# EAGLE design bq25570 (EAGLE 7.2.0)
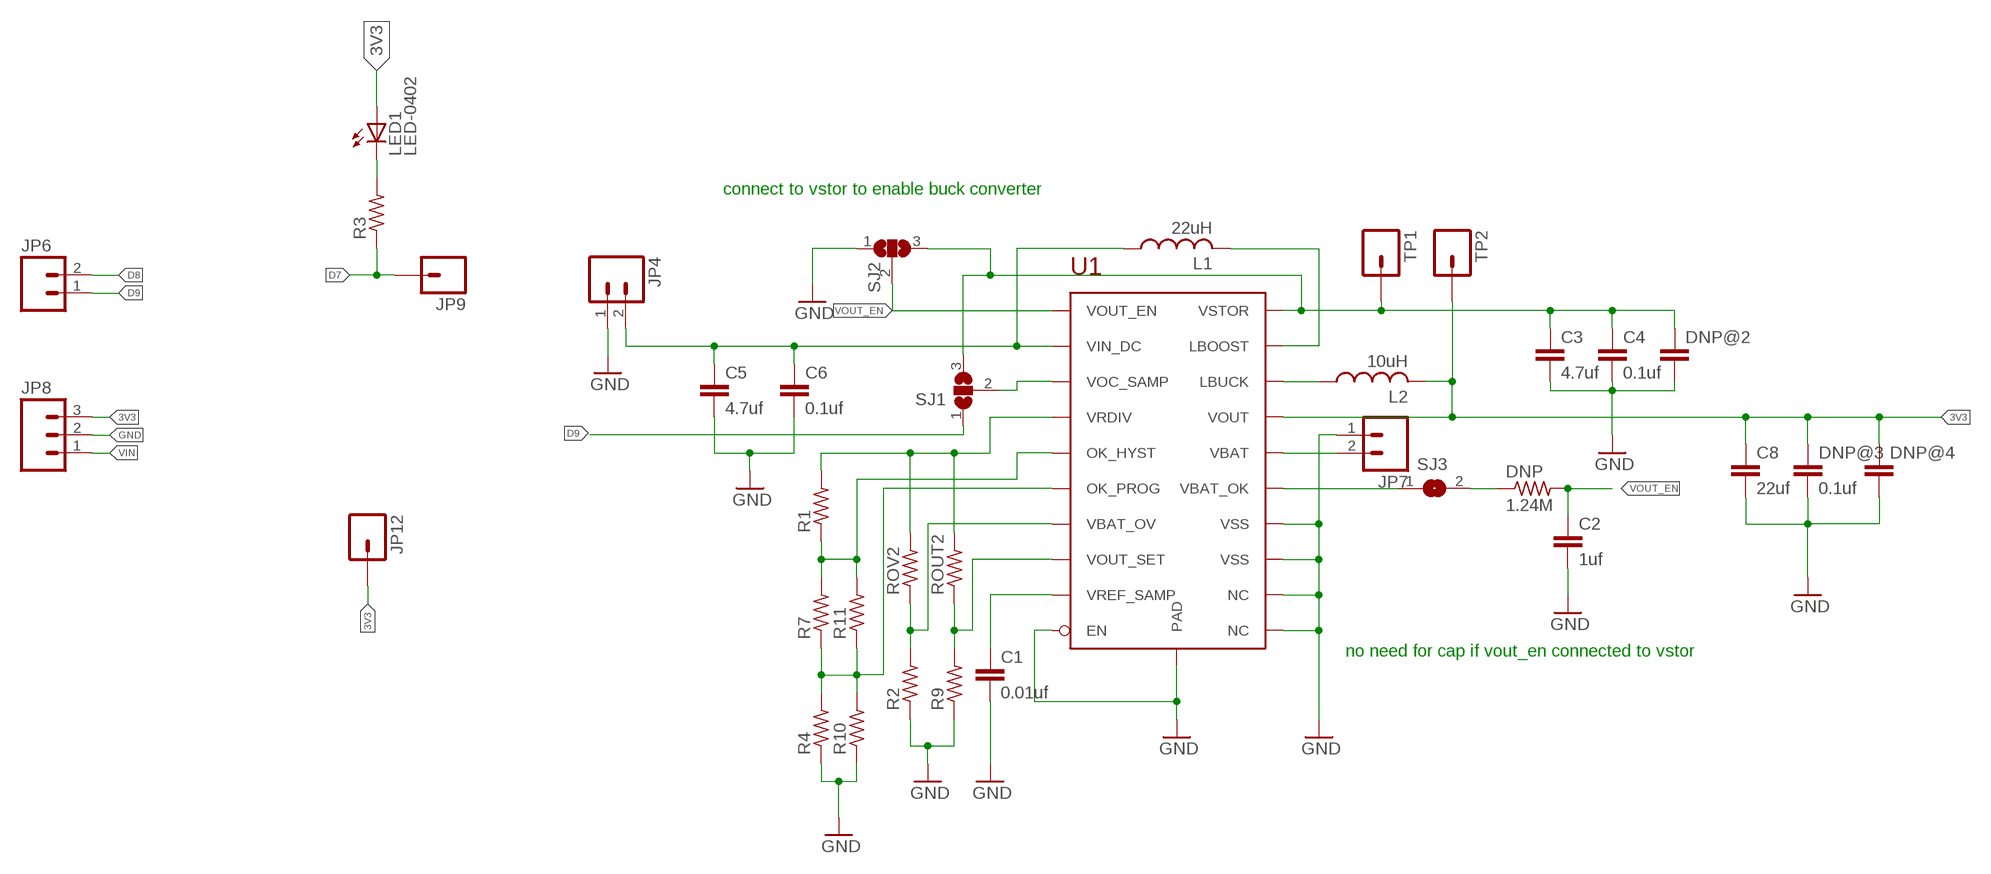
[diagram p0: schematic, sheet 1]

## Parts
C1  0.01uf  C-EUC0805  [C0805]
C2  1uf  C-EUC0805  [C0805]
C3  4.7uf  C-EUC0805  [C0805]
C4  0.1uf  C-EUC0805  [C0805]
C5  4.7uf  C-EUC0805  [C0805]
C6  0.1uf  C-EUC0805  [C0805]
C8  22uf  C-EUC0805  [C0805]
DNP  1.24M  R-US_M0805  [M0805]
DNP@2  C-EUC0805  [C0805]
DNP@3  0.1uf  C-EUC0805  [C0805]
DNP@4  C-EUC0805  [C0805]
JP4  M02-JST-2-PTH-NO_SILK  [JST-2-PTH-NS]
JP6  M02PTH  [1X02]
JP7  M02-JST-2-PTH-NO_SILK  [JST-2-PTH-NS]
JP8  M03PTH  [1X03]
JP9  M01PTH  [1X01]
JP12  M01PTH  [1X01]
L1  22uH  LPS6235  [LPS6235]
L2  10uH  LPS6235  [LPS6235]
LED1  LED-0402  [0402]
R1  R-US_R0603  [R0603]
R2  R-US_R0603  [R0603]
R3  R-US_R0603  [R0603]
R4  R-US_R0603  [R0603]
R7  R-US_R0805  [R0805]
R9  R-US_R0805  [R0805]
R10  R-US_R0805  [R0805]
R11  R-US_R1206  [R1206]
ROUT2  R-US_R0603  [R0603]
ROV2  R-US_R0805  [R0805]
SJ1  SJ2W  [SJ_2]
SJ2  SJ2W  [SJ_2]
SJ3  SJ  [SJ]
TP1  M01PTH  [1X01]
TP2  M01PTH  [1X01]
U1  BQ25570  [QFN-20]

## Nets
3V3: C8.1 DNP@3.1 DNP@4.1 JP8.3 JP12.1 L2.P$2 LED1.P$1(A) TP2.1 U1.P$14(VOUT)
D7: JP9.1 R3.1
D8: JP6.2
D9: JP6.1 SJ1.1
GND: C1.2 C2.2 C3.2 C4.2 C5.2 C6.2 C8.2 DNP@2.2 DNP@3.2 DNP@4.2 JP4.1 JP7.1 JP8.2 R2.1 R4.1 R9.1 R10.1 SJ2.1 U1.P$1(VSS) U1.P$5(EN) U1.P$9(NC) U1.P$15(VSS) U1.P$17(NC) U1.P$21(PAD)
N$1: L1.P$2 U1.P$20(LBOOST)
N$3: L2.P$1 U1.P$16(LBUCK)
N$4: SJ1.2 U1.P$3(VOC_SAMP)
N$6: JP7.2 U1.P$18(VBAT)
N$7: C1.1 U1.P$4(VREF_SAMP)
N$8: SJ3.1 U1.P$13(VBAT_OK)
N$10: R1.2 ROUT2.2 ROV2.2 U1.P$8(VRDIV)
N$11: DNP.1 SJ3.2
N$12: R9.2 ROUT2.1 U1.P$12(VOUT_SET)
N$13: R2.2 ROV2.1 U1.P$7(VBAT_OV)
N$14: R1.1 R7.2 R11.2 U1.P$10(OK_HYST)
N$16: LED1.P$2(C) R3.2
N$17: R4.2 R7.1 R10.2 R11.1 U1.P$11(OK_PROG)
VIN: JP8.1
VIN_DC: C5.1 C6.1 JP4.2 L1.P$1 U1.P$2(VIN_DC)
VOUT_EN: C2.1 DNP.2 SJ2.2 U1.P$6(VOUT_EN)
VSTOR: C3.1 C4.1 DNP@2.1 SJ1.3 SJ2.3 TP1.1 U1.P$19(VSTOR)

## Notes on the sheet
- connect to vstor to enable buck converter
- no need for cap if vout_en connected to vstor

## Library data of the parts
C1-C6 C8 DNP@2-DNP@4 = rcl:C-EU: CAPACITOR, European symbol
DNP R1 R2 R4 R7 R9-R11 ROUT2 ROV2 = rcl:R-US_: RESISTOR, American symbol
JP4 JP6 JP7 = SparkFun-Connectors:M02: Standard 2-pin 0.1" header. Use with - straight break away headers ( PRT-00116) - right angle break away headers (PRT-00553) - swiss pins (PRT-00743) - machine pins (PRT-00117) - female headers (PRT-00115) Molex polarized connector foot print use with: PRT-08233 with associated crimp pins and housings. 2.54_SCREWTERM for use with PRT-10571. 3.5mm Screw Terminal footprints for PRT-08084 5mm Screw Terminal footprints for use with PRT-08432
JP8 = SparkFun-Connectors:M03: Header 3 Standard 3-pin 0.1" header. Use with straight break away headers (SKU : PRT-00116), right angle break away headers (PRT-00553), swiss pins (PRT-00743), machine pins (PRT-00117), and female headers (PRT-00115). Molex polarized connector foot print use with SKU : PRT-08232 with associated crimp pins and housings.
JP9 JP12 TP1 TP2 = SparkFun-Connectors:M01: Header 1 Standard 1-pin 0.1" header. Use with straight break away headers (SKU : PRT-00116), right angle break away headers (PRT-00553), swiss pins (PRT-00743), machine pins (PRT-00117), and female headers (PRT-00115).
L1 L2 = lps6235:LPS6235
LED1 = led-0402:LED-0402
R3 = resistor:R-US_: RESISTOR, American symbol
SJ1 SJ2 = jumper:SJ2W: SMD solder JUMPER
SJ3 = jumper:SJ: SMD solder JUMPER
U1 = bq25570:BQ25570

## Board
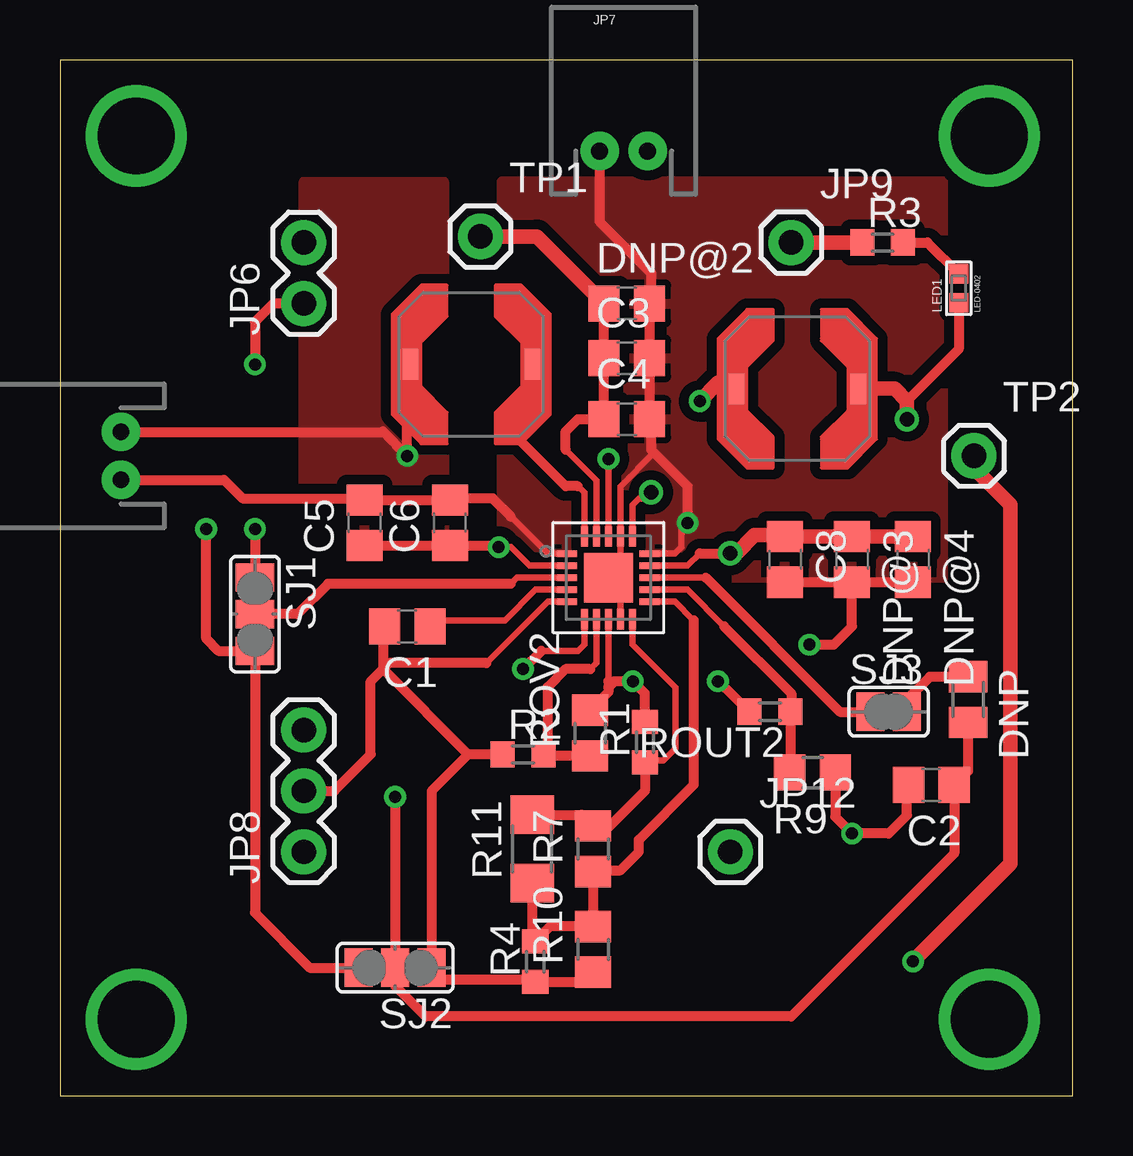
[diagram p1: board, top side]
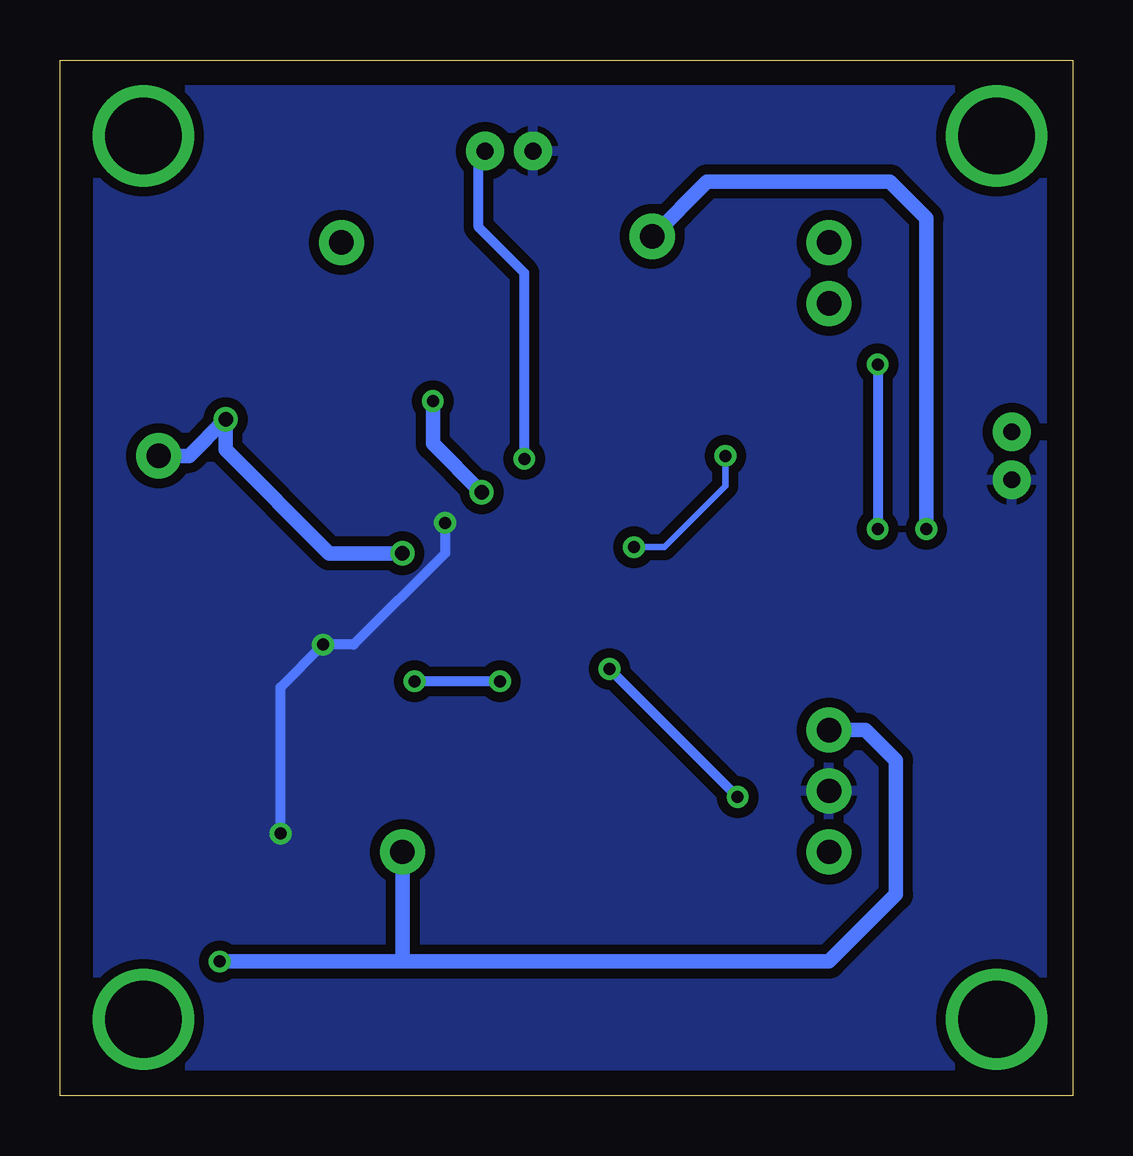
[diagram p2: board, bottom side, seen from below]

Size 42.22 x 43.17 mm. Coordinates in mm from the lower left corner, seen from the top.
Outline: 0,0 42.22,0 42.22,43.17 0,43.17 0,0
Copper layers (1*16): Top 0.035mm / dielectric 1.5mm / Bottom 0.035mm
Design rules "default": minimum track width 10mil, minimum drill 24mil, track to track 8mil, track to pad 8mil, pad to pad 8mil, via to via 8mil, smd to smd 8mil, copper to edge 40mil, drill to drill 8mil, minimum pad ring 10mil, minimum via ring 8mil, stop-mask expansion 4mil, vias tented up to drill 0mil, thermal gap 10mil

### Footprints (pad centres in the part's own frame; a part is rotated, then mirrored left to right if it is on the bottom)
C0805 = smd 1.3 x 1.5: 1 -0.95,0; 2 0.95,0
M0805 = smd 1.3 x 1.6: 1 -0.95,0; 2 0.95,0
JST-2-PTH-NS = drill 0.7 pad 1.6: 1 -1,0; 2 1,0
1X02 = drill 1.016 pad 1.88: 1 0,0; 2 2.54,0
1X03 = drill 1.016 pad 1.88: 1 0,0; 2 2.54,0; 3 5.08,0
1X01 = drill 1.016 pad 1.88: 1 0,0
LPS6235 = smd 0.635 x 1.27: P$1 -2.54,0; P$2 2.54,0
0402 = smd 0.8 x 0.8: P$1 -0.6,0; P$2 0.6,0
R0603 = smd 1 x 1.1: 1 -0.85,0; 2 0.85,0
R0805 = smd 1.3 x 1.5: 1 -0.95,0; 2 0.95,0
R1206 = smd 1.6 x 1.803: 1 -1.422,0; 2 1.422,0
SJ_2 = smd 1.168 x 1.6: 1 -1.524,0; 2 0,0; 3 1.524,0
SJ = smd 1.168 x 1.6: 1 -0.762,0; 2 0.762,0
QFN-20 = smd 0.85 x 0.28: P$1 -1.725,1; P$2 -1.725,0.5; P$3 -1.725,0; P$4 -1.725,-0.5; P$5 -1.725,-1; P$11 1.725,-1; P$12 1.725,-0.5; P$13 1.725,0; P$14 1.725,0.5; P$15 1.725,1 | smd 0.28 x 0.85: P$6 -1,-1.725; P$7 -0.5,-1.725; P$8 0,-1.725; P$9 0.5,-1.725; P$10 1,-1.725; P$16 1,1.725; P$17 0.5,1.725; P$18 0,1.725; P$19 -0.5,1.725; P$20 -1,1.725 | smd 2.05 x 2.05: P$21 0,0

### Placement (x,y rotation side)
C1  14.48,19.56 180 top
C2  36.32,12.95 180 top
C3  23.62,30.73 0 top
C4  23.62,28.19 0 top
C5  12.7,23.88 90 top
C6  16.26,23.88 90 top
C8  30.23,22.35 270 top
DNP  37.85,16.51 270 top
DNP@2  23.62,33.02 0 top
DNP@3  33.02,22.35 270 top
DNP@4  35.56,22.35 270 top
JP4  2.54,26.67 90 top
JP6  10.16,33.02 90 top
JP7  23.49,39.37 0 top
JP8  10.16,10.16 90 top
JP9  30.48,35.56 0 top
JP12  27.94,10.16 0 top
L1  17.15,30.48 0 top
L2  30.73,29.46 0 top
LED1  37.47,33.66 90 top
R1  24.38,14.73 90 top
R2  19.3,14.22 0 top
R3  34.29,35.56 0 top
R4  19.81,5.59 90 top
R7  22.23,10.29 90 top
R9  31.37,13.46 180 top
R10  22.23,6.1 90 top
R11  19.69,10.29 90 top
ROUT2  29.59,16 180 top
ROV2  22.1,15.11 90 top
SJ1  8.13,20.07 270 top
SJ2  13.97,5.33 180 top
SJ3  34.54,16 0 top
TP1  17.53,35.81 0 top
TP2  38.1,26.67 0 top
U1  22.86,21.59 0 top

### Tracks (layer width: path | path; a pad name or v marks a point on that pad's centre or on a via)
3V3  (via drill 0.5, 0.6)
  Top 0.279: U1.P$14 26.15,22.09 26.67,22.61
  Top 0.406: 26.67,22.61 v27.94,22.61 | 35.31,28.96 37.47,31.11 LED1.P$1
  Top 0.61: v35.31,28.19 35.31,28.96 34.8,29.46 L2.P$2 | DNP@4.1 DNP@3.1 C8.1 30.16,23.37 28.96,23.37 28.19,22.61 v27.94,22.61 | TP2.1 38.1,26.16 39.62,24.64 39.62,9.65 v35.56,5.59
  Bottom 0.61: v27.94,22.61 30.99,22.61 35.31,26.92 v35.31,28.19 36.83,26.67 TP2.1 | v35.56,5.59 27.94,5.59 | 27.94,5.59 10.16,5.59 7.37,8.38 7.37,13.97 8.64,15.24 JP8.3 | JP12.1 27.94,5.59
D7
  Top 0.61: JP9.1 R3.1
D9  (via drill 0.5)
  Top 0.406: v8.13,23.62 SJ1.1 | JP6.1 8.89,33.02 8.13,32.26 v8.13,30.48
  Bottom 0.406: v8.13,30.48 v8.13,23.62
GND  (via drill 0.5)
  Top 0.279: U1.P$9 23.36,21.09 U1.P$21 23.37,22.1 23.37,22.35 23.36,22.36 U1.P$17 23.36,25.39 24.77,26.8 | 24.64,27.87 C4.2 | U1.P$5 20.34,20.59 17.78,18.03 | U1.P$15 25.64,22.59 25.91,22.86 25.91,23.62 v26.16,23.88 | U1.P$1 20.34,22.59 18.8,24.13
  Top 0.406: C4.2 C3.2 DNP@2.2 24.64,33.09 24.64,34.29 22.49,36.43 JP7.1 | R10.1 21.82,4.74 R4.1 19.72,4.83 16,4.83 SJ2.1 15.49,12.7 17.02,14.22 | C8.2 DNP@3.2 | DNP@3.2 DNP@4.2 | C2.2 35.31,12.89 35.31,11.68 34.54,10.92 v33.02,10.92 32.32,11.62 R9.1 | v31.24,18.8 32.26,18.8 33.02,19.56 DNP@3.2 | 24.64,27.87 24.64,26.92 24.77,26.8 26.16,25.4 v26.16,23.88 | 18.8,24.13 18.03,24.89 16.32,24.89 C6.2 C5.2 12.63,24.89 7.62,24.89 6.84,25.67 JP4.1 | JP8.2 11.43,12.7 12.95,14.22 12.95,17.27 13.46,17.78 | C1.2 13.46,19.49 13.46,17.78 | R2.1 17.02,14.22 | 13.46,17.78 17.02,14.22 | 17.78,18.03 13.72,18.03 13.46,17.78
  Bottom 0.406: v26.16,23.88 26.16,22.61 29.97,18.8 v31.24,18.8 33.02,17.02 v33.02,10.92
  pour Bottom (isolate 0.406): 1.27,41.91 40.64,41.91 40.64,1.27 1.27,1.27
  pour Top (isolate 0.406): 36.83,38.1 18.41,38.1 18.41,21.59 36.83,21.59
N$1
  Top 0.279: U1.P$20 21.86,25.13 21.59,25.4
  Top 0.406: 19.05,27.94 19.05,28.96 | 19.05,28.96 19.56,29.46 19.56,30.35 L1.P$2 | 21.59,25.4 21.08,25.4 18.54,27.94 18.54,28.45 19.05,28.96
N$2  (via drill 3.2)
  other vias: 38.73,40.01
N$3  (via drill 0.5, 0.6)
  Top 0.279: U1.P$16 23.86,24.62 24.13,24.89 24.38,24.89 v24.64,25.15
  Top 0.406: 28.19,28.96 L2.P$1 27.94,29.72 27.43,29.72
  Top 0.61: v26.67,28.96 27.43,29.72
  Bottom 0.61: v24.64,25.15 26.67,27.18 v26.67,28.96
N$4
  Top 0.279: U1.P$3 19.05,21.59 18.8,21.34
  Top 0.406: 18.8,21.34 11.18,21.34 9.91,20.07 SJ1.2
N$5  (via drill 3.2)
  other vias: 38.73,3.17
N$6  (via drill 0.5)
  Top 0.279: U1.P$18 v22.86,26.54
  Bottom 0.406: v22.86,26.54 22.86,34.29 24.77,36.2 24.77,39.1 JP7.2
N$7
  Top 0.279: U1.P$4 19.82,21.09 18.54,19.81 15.68,19.81 C1.1
N$8
  Top 0.279: U1.P$13 26.92,21.59
  Top 0.406: 26.92,21.59 32.51,16 SJ3.1
N$9  (via drill 3.2)
  other vias: 3.18,3.17
N$10  (via drill 0.5)
  Top 0.279: U1.P$8 22.86,17.27
  Top 0.406: 22.86,17.27 22.86,17.02 | 22.86,17.02 22.86,16.82 ROV2.2 | R1.2 24.38,16.76 v23.88,17.27 23.11,17.27 22.86,17.02 | v27.43,17.27 27.47,17.27 ROUT2.2
  Bottom 0.406: v23.88,17.27 v27.43,17.27
N$11
  Top 0.406: DNP.1 36.26,17.46 35.31,16.51 SJ3.2
N$12
  Top 0.279: U1.P$12 26.15,21.09 27.69,19.56
  Top 0.406: 30.44,13.56 R9.2 30.44,13.48 ROUT2.1 30.48,16.04 30.48,16.76 27.69,19.56
N$13
  Top 0.279: U1.P$7 22.36,18.04 22.1,17.78 | 20.32,14.39 R2.2
  Top 0.406: ROV2.1 20.22,14.16 R2.2 | 22.1,17.78 21.08,17.78 20.32,17.02 20.32,14.39
N$14
  Top 0.279: U1.P$10 23.86,18.81 25.65,17.02 25.65,14.48 25.15,13.97 24.47,13.97 R1.1
  Top 0.406: R1.1 24.38,12.7 22.61,10.92 22.54,10.92 R7.2 21.75,11.71 R11.2
N$15  (via drill 3.2)
  other vias: 3.18,40.01
N$16
  Top 0.406: R3.2 36.16,35.56 LED1.P$2
N$17
  Top 0.279: U1.P$11 25.64,20.59 26.42,19.81
  Top 0.406: R11.1 19.69,6.57 R4.2 20.42,7.05 R10.2 R7.1 22.29,9.4 23.37,9.4 24.13,10.16 24.13,10.67 26.42,12.95 26.42,19.81
VIN_DC  (via drill 0.5)
  Top 0.279: U1.P$2 19.57,22.09 18.8,22.86 v18.29,22.86
  Top 0.406: L1.P$1 14.48,30.35 v14.48,26.67 13.46,27.69 13.45,27.67 JP4.2 | C5.1 C6.1 18.22,22.93 v18.29,22.86
  Bottom 0.279: v14.48,26.67 14.48,25.4 17.02,22.86 v18.29,22.86
  pour Top (isolate 0.406): 10.16,38.1 16,38.1 16,23.49 10.16,23.49
VOUT_EN  (via drill 0.5)
  Top 0.279: U1.P$6 21.86,18.81 21.59,18.54 20.07,18.54
  Top 0.406: v19.3,17.78 20.07,18.54 | DNP.2 37.85,13.53 C2.1 37.27,10.09 30.48,3.3 15.24,3.3 13.97,4.57 SJ2.2 13.97,5.84 v13.97,12.45
  Bottom 0.406: v13.97,12.45 v19.3,17.78
VSTOR  (via drill 0.5)
  Top 0.279: 22.36,27.63 C4.1 | U1.P$19 22.36,25.65 21.08,26.92
  Top 0.406: DNP@2.1 C3.1 C4.1 21.59,28.19 21.08,27.69 21.08,26.92 | v6.1,23.62 6.1,19.05 6.6,18.54 SJ1.3 8.13,7.62 10.41,5.33 SJ2.3
  Top 0.61: TP1.1 19.88,35.81 DNP@2.1
  Bottom 0.61: v6.1,23.62 6.1,36.58 7.62,38.1 15.24,38.1 TP1.1